# Altium schematic sheet Atmega328.SchDoc
size A; SheetNumber: 1; SheetTotal: 1
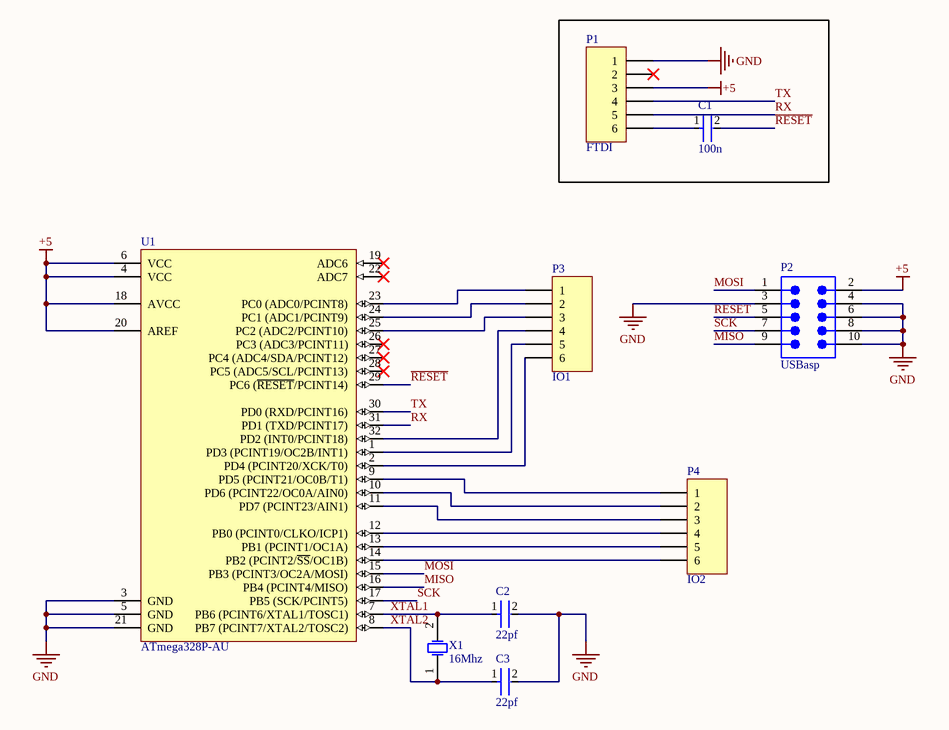
[diagram p0: Atmega328.SchDoc]

## Parts
C1  100n  [FP-0805-L_2_01_0_2-W_1_25-IPC_B]
C2  22pf  [FP-C0805C-DN-MFG]
C3  22pf  [FP-C0805C-DN-MFG]
P1  FTDI  [MHDR1X6]
P2  USBasp  [61201021621]
P3  IO1  [MHDR1X6]
P4  IO2  [MHDR1X6]
U1  ATmega328P-AU  [32A_M]
X1  16Mhz  [FOX-FOXSDLF160-20_V]

## Nets
+5: P1.3 P2.2 U1.4(VCC) U1.6(VCC) U1.18(AVCC) U1.20(AREF)
GND: C2.2 C3.2 P1.1 P2.3 P2.4 P2.6 P2.8 P2.10 U1.3(GND) U1.5(GND) U1.21(GND)
MISO: P2.9 U1.16(PB4_(PCINT4/MISO))
MOSI: P2.1 U1.15(PB3_(PCINT3/OC2A/MOSI))
~{RESET}: C1.2 P2.5 U1.29(PC6_(~{RESET}/PCINT14))
RX: P1.5 U1.31(PD1_(TXD/PCINT17))
SCK: P2.7 U1.17(PB5_(SCK/PCINT5))
TX: P1.4 U1.30(PD0_(RXD/PCINT16))
XTAL1: C2.1 U1.7(PB6_(PCINT6/XTAL1/TOSC1)) X1.2(X2)
XTAL2: C3.1 U1.8(PB7_(PCINT7/XTAL2/TOSC2)) X1.1(X1)
NetC1_1: C1.1 P1.6
NetP3_1: P3.1 U1.23(PC0_(ADC0/PCINT8))
NetP3_2: P3.2 U1.24(PC1_(ADC1/PCINT9))
NetP3_3: P3.3 U1.25(PC2_(ADC2/PCINT10))
NetP3_4: P3.4 U1.32(PD2_(INT0/PCINT18))
NetP3_5: P3.5 U1.1(PD3_(PCINT19/OC2B/INT1))
NetP3_6: P3.6 U1.2(PD4_(PCINT20/XCK/T0))
NetP4_1: P4.1 U1.9(PD5_(PCINT21/OC0B/T1))
NetP4_2: P4.2 U1.10(PD6_(PCINT22/OC0A/AIN0))
NetP4_3: P4.3 U1.11(PD7_(PCINT23/AIN1))
NetP4_4: P4.4 U1.12(PB0_(PCINT0/CLKO/ICP1))
NetP4_5: P4.5 U1.13(PB1_(PCINT1/OC1A))
NetP4_6: P4.6 U1.14(PB2_(PCINT2/~{SS}/OC1B))

Not connected (* = marked no-connect by the designer): P1 2*; U1 19(ADC6)* 22(ADC7)* 26(PC3_(ADC3/PCINT11))* 27(PC4_(ADC4/SDA/PCINT12))* 28(PC5_(ADC5/SCL/PCINT13))*

## Library data of the parts
C1 = CMP-2007-04174-2: General Purpose Ceramic Capacitor, 0805, 100nF, 10%, X7R, 15%, 100V; Packaging: Tape and Reel; Min Operating Temperature: -55°C; Dielectric Material: Ceramic; Height: 1.4mm; Voltage Rating: 100V; Termination: SMD/SMT; Case Code (Imperial): 0805; Case Code (Metric): 2012; Case/Package: 0805; Construction: Flat; Radiation Hardening: No; Series: -; Dielectric: X7R; Package Quantity: 2000; Mount: Surface Mount; Capacitance: 100nF; Contact Plating: Tin; Voltage: 100V; Lead Free: Lead Free; Depth: 1.25mm; RoHS Compliant: Yes; Number of Pins: 2; Max Operating Temperature: 125°C; Length: 2.01mm; Voltage Rating (DC): 100V; Thickness: 0.055inch; REACH SVHC: No SVHC; Width: 0.049inch; Tolerance: 10%
C2 C3 = CMP-2007-00048-2: Capacitor; Ceramic; Cap; 22.0pF; Tol 5%; SMT; Vol-Rtg 50V; C0G; Tape and Reel; Manufacturer: KEMET; Manufacturer Part Number: C0805C220J5GACTU; Temperature Coefficient: 30ppm/°C; Tolerance: 0.05; Device Class L1: Passive Components; Mouser Description: Multilayer Ceramic Capacitors MLCC - SMD/SMT 50volts 22pF C0G 5%; Temperature Range Low: -55°C; Automotive: No; Voltage Rating: 50 V; Material: Ceramic; Category: Cap; Height: 0.88mm; Temperature Range High: +125°C; Capacitance: 22 pF; Digikey Description: Capacitor; Ceramic; Cap; 22.0pF; Tol 5%; SMT; Vol-Rtg 50V; C0G; Tape and Reel; Octopart: https://octopart.com/c0805c220j5gactu-kemet-145470; ComponentLink2Description: Datasheet; Device Class L2: Capacitors; Ipc Land Pattern Name: CAPC200125X78; Value: 22 pF; RoHS: TRUE; ComponentLink2URL: https://content.kemet.com/datasheets/KEM_C1003_C0G_SMD.pdf; Temperature: -55°C to +125°C; Device Class L3: Ceramic Capacitors; Lead Free: Yes; Temperature Characteristic: C0G; Package: C0805C-DN
P1 P3 P4 = MHDR1X6: Header, 6-Pin; LatestRevisionDate: 17-Jul-2002; LatestRevisionNote: Re-released for DXP Platform.; Publisher: Altium Limited
P2 = CMP-1502-00007-2: NexarPartId: 8917783; Number of Contacts: 10; Voltage Rating (DC): 250V; Insulation Resistance: 1GΩ; Current Rating: 3A; Row Spacing: 2.54mm; Contact Resistance: 20mΩ; Connector Type: Male Pin; Gender: Male; Flammability Rating: UL94 V-0; Termination: Solder; Width: 20.36mm; Length: 20.36mm; Housing Material: PBT; Operating Supply Voltage: 250V; Min Operating Temperature: -40°C; Lead Free: Lead Free; Insulation Material: PBT; Orientation: Vertical; RoHS: Compliant; Voltage Rating: 250V; Number of Pins: 10; Height: 8.85mm; REACH SVHC: Unknown; Contact Material: Copper; Contact Gender: Male; Color: Black; Mount: Through Hole; Contact Plating: Gold; Lead Pitch: 2.54mm; Number of Positions: 10; Pitch: 2.54mm; Max Operating Temperature: 105°C; Number of Rows: 2
U1 = CMP-0095-00269-2: 8-bit AVR Microcontroller, 32KB Flash, 1KB EEPROM, 2KB SRAM, 32-pin TQFP, Industrial Grade (-40°C to 85°C); PackageDescription: 32-Lead, 7x7x1.0 mm Body, 0.8mm Lead Pitch, Thin Profile Plastic Quad Flat Package (TQFP); DatasheetVersion: revD, May-2011; RevisionNote: DatasheetVersion & PackageVersion updated. URLs added.; ComponentLink1URL: http://www.atmel.com/; ComponentLink2Description: ATmega48A/48PA/88A/88PA/168A/168PA/328/328P Datasheet; Code_JEDEC: MS-026-ABA; ComponentLink1Description: Manufacturer URL; PackageReference: 32A; ComponentLink3Description: ATmega48A/48PA/88A/88PA/168A/168PA/328/328P Summary; ComponentLink2URL: http://www.atmel.com/dyn/resources/prod_documents/doc8271.pdf; PackageVersion: revC, Oct-2010; ComponentLink3URL: http://www.atmel.com/dyn/resources/prod_documents/8271S.pdf
X1 = CMP-1749-00001-1: Resistance Weld SMD Crystal, 16 MHz, +/- 30 ppm, 20 pF, -20 to 70 degC, 2-Pin SMD, RoHS, Tape and Reel; Output Current: 3 mA; Case\Package: SOT-553-6; Min Supply Voltage (DC): 4 V; Max Supply Voltage: 3.3 V; Min Supply Voltage: 1.4 V; Interface: I2C; Max Supply Voltage (DC): 6 V; ComponentLink2Description: Datasheet; REACH SVHC: No SVHC; ComponentLink1URL: http://www.foxonline.com/; ComponentLink2URL: http://foxonline.com/pdfs/hc49sdlf.pdf; Pins: 6; Packaging: Cut Tape; ComponentLink1Description: Manufacturer URL; Weight: 9.9E-05 oz; Length: 1.6 mm; RoHSCompliant: true; Min Operating Temperature: -55 degC; Radiation Hardening: No; PackageDescription: 2-Pin Surface Mount Device, Body 5 x 11.7 mm, Height 4.5 mm; Package Quantity: 1; Width: 1.2 mm; DatasheetVersion: Mar-15; Max Operating Temperature: 150 degC; Mount: Surface Mount; PackageReference: FOX-FOXSDLF160-20; Height: 0.55 mm